# Altium project driver_led_matrix.PrjPcb
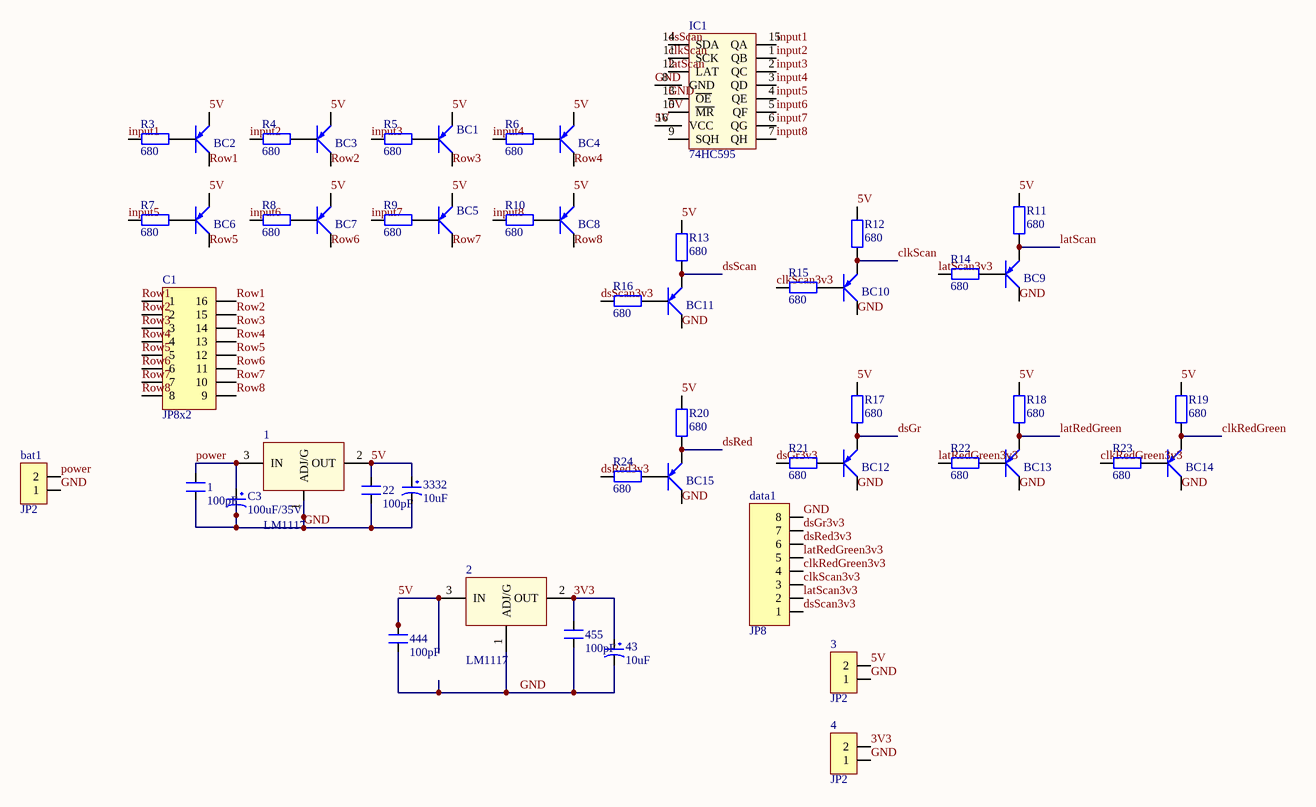
[diagram p0: Sheet1.SchDoc]
1 sheet, 52 parts. Net scope: global (net labels, ports and power ports of the same name join across sheets).
Board file: PCB2.PcbDoc

## Sheet Sheet1.SchDoc
size A0

### Parts
(Parts that share a designator on the sheet are numbered #1, #2 ... from top to bottom, then left to right.)
1#1  LM1117  [SOT223-4N]
1#2  100pF  [CN1]
2  LM1117  [SOT223-4N]
3  JP2  [JP2-C1T]
4  JP2  [JP2-C1T]
22  100pF  [CN1]
43  10uF  [CP1/2]
444  100pF  [CN1]
455  100pF  [CN1]
3332  10uF  [CP1/2]
bat1  JP2  [JP2-C1T]
BC1  A1015  [SOT23B]  (value not drawn)
BC2  A1015  [SOT23B]  (value not drawn)
BC3  A1015  [SOT23B]  (value not drawn)
BC4  A1015  [SOT23B]  (value not drawn)
BC5  A1015  [SOT23B]  (value not drawn)
BC6  A1015  [SOT23B]  (value not drawn)
BC7  A1015  [SOT23B]  (value not drawn)
BC8  A1015  [SOT23B]  (value not drawn)
BC9  A1015  [SOT23B]  (value not drawn)
BC10  A1015  [SOT23B]  (value not drawn)
BC11  A1015  [SOT23B]  (value not drawn)
BC12  A1015  [SOT23B]  (value not drawn)
BC13  A1015  [SOT23B]  (value not drawn)
BC14  A1015  [SOT23B]  (value not drawn)
BC15  A1015  [SOT23B]  (value not drawn)
C1  JP8x2  [JP8-D2T]
C3  100uF/35V  [CP1.5/3.4]
data1  JP8  [JP8-D1C]
IC1  74HC595  [SO16]
R3  680  [R1/4W]
R4  680  [R1/4W]
R5  680  [R1/4W]
R6  680  [R1/4W]
R7  680  [R1/4W]
R8  680  [R1/4W]
R9  680  [R1/4W]
R10  680  [R1/4W]
R11  680  [R1/4W]
R12  680  [R1/4W]
R13  680  [R1/4W]
R14  680  [R1/4W]
R15  680  [R1/4W]
R16  680  [R1/4W]
R17  680  [R1/4W]
R18  680  [R1/4W]
R19  680  [R1/4W]
R20  680  [R1/4W]
R21  680  [R1/4W]
R22  680  [R1/4W]
R23  680  [R1/4W]
R24  680  [R1/4W]

### Nets
5V: 1#1.2(OUT) 2.3(IN) 3.2 22.2 444.2 3332.1 BC1.1(E) BC2.1(E) BC3.1(E) BC4.1(E) BC5.1(E) BC6.1(E) BC7.1(E) BC8.1(E) IC1.10(~{MR}) IC1.16(VCC) R11.2 R12.2 R13.2 R17.2 R18.2 R19.1 R20.2  [also labelled VCC]
GND: 1#1.1(ADJ/G) 1#2.1 2.1(ADJ/G) 3.1 4.1 22.1 43.2 444.1 455.1 3332.2 bat1.1 BC9.2(C) BC10.2(C) BC11.2(C) BC12.2(C) BC13.2(C) BC14.2(C) BC15.2(C) C3.2 data1.8 IC1.8(GND) IC1.13(~{OE})
3V3: 2.2(OUT) 4.2 43.1 455.2
clkRedGreen: BC14.1(E) R19.2
clkRedGreen3v3: data1.4 R23.2
clkScan: BC10.1(E) IC1.11(SCK) R12.1
clkScan3v3: data1.3 R15.1
dsGr: BC12.1(E) R17.1
dsGr3v3: data1.7 R21.1
dsRed: BC15.1(E) R20.1
dsRed3v3: data1.6 R24.1
dsScan: BC11.1(E) IC1.14(SDA) R13.1
dsScan3v3: data1.1 R16.1
input1: IC1.15(QA) R3.1
input2: IC1.1(QB) R4.1
input3: IC1.2(QC) R5.1
input4: IC1.3(QD) R6.1
input5: IC1.4(QE) R7.1
input6: IC1.5(QF) R8.1
input7: IC1.6(QG) R9.1
input8: IC1.7(QH) R10.1
latRedGreen: BC13.1(E) R18.1
latRedGreen3v3: data1.5 R22.1
latScan: BC9.1(E) IC1.12(LAT) R11.1
latScan3v3: data1.2 R14.1
power: 1#1.3(IN) 1#2.2 bat1.2 C3.1
Row1: BC2.2(C) C1.1 C1.16
Row2: BC3.2(C) C1.2 C1.15
Row3: BC1.2(C) C1.3 C1.14
Row4: BC4.2(C) C1.4 C1.13
Row5: BC6.2(C) C1.5 C1.12
Row6: BC7.2(C) C1.6 C1.11
Row7: BC5.2(C) C1.7 C1.10
Row8: BC8.2(C) C1.8 C1.9
NetBC1_3: BC1.3(B) R5.2
NetBC2_3: BC2.3(B) R3.2
NetBC3_3: BC3.3(B) R4.2
NetBC4_3: BC4.3(B) R6.2
NetBC5_3: BC5.3(B) R9.2
NetBC6_3: BC6.3(B) R7.2
NetBC7_3: BC7.3(B) R8.2
NetBC8_3: BC8.3(B) R10.2
NetBC9_3: BC9.3(B) R14.2
NetBC10_3: BC10.3(B) R15.2
NetBC11_3: BC11.3(B) R16.2
NetBC12_3: BC12.3(B) R21.2
NetBC13_3: BC13.3(B) R22.2
NetBC14_3: BC14.3(B) R23.1
NetBC15_3: BC15.3(B) R24.2

Not connected (* = marked no-connect by the designer): IC1 9(SQH)

### Library data of the parts
1#1 2 = LM1117: Available in 1.8V, 2.5V, 2.85V, 3.3V, 5V, and  Adjustable Versions; Value: LM317
1#2 22 444 455 = CN1: Cap np  1pF - 472pF; Value: 100pF
3 4 bat1 = JP2: WR-PHD 2.54 mm Angled Socket Header; Manufacturer: W¨¹rth Elektronik eiSos GmbH; partNo: 613002143121; ComponentLink1 Description: Manufacturer; ComponentLink2 Description: Datasheet; NoPins: 02; Created Date: 29 March 2013; ComponentLink1URL: http://www.we-online.com; ComponentLink2URL: http://katalog.we-online.de/em/datasheet/6130xx143121.pdf; Created by: Karrer Zheng
43 3332 = CP1: Cap P  0,1uF < 22uF , 16 - 50V; Value: 10uF/50V; Description 1: 10 => 220uF/6,3V/10V - 10uF => 100uF/16V; Description 2: 0,1uF => 33uF/50V - 10uF => 22uF/63V; Description 3: 0,47uF => 10uF/100V
BC1-BC15 = A1015: PNP 600mW, ECB; Value: A1015
C1 = JP8x2: WR-PHD 2.54 mm Dual Socket Header; Manufacturer: W¨¹rth Elektronik eiSos GmbH; partNo: 61301621821; ComponentLink1 Description: Manufacturer; ComponentLink2 Description: Datasheet; NoPins: 16; Created Date: 29 March 2013; ComponentLink1URL: http://www.we-online.com; ComponentLink2URL: http://katalog.we-online.de/em/datasheet/6130xx21821.pdf; Created by: Karrer Zheng
C3 = CP3: Cap 100uF/35V - 470uF/16V; Value: 100uF/35V/50V; Description 1: 1000uF/6,3V - 470uF/16V - 330uF - 25V; Description 2: 220uF/35V - 100uF/50V - 63V - 4,7uF/200V; Description 3: 22uF => 33uF100V - 3,3uF => 4,7uF/250V; Description 4: 2,2uF =>3,3uF/350 - 2,2uF/400V - 1uF/450V
data1 = JP8: WR-PHD 2.54 mm Angled Socket Header; Manufacturer: W¨¹rth Elektronik eiSos GmbH; partNo: 613008143121; ComponentLink1 Description: Manufacturer; ComponentLink2 Description: Datasheet; NoPins: 08; Created Date: 29 March 2013; ComponentLink1URL: http://www.we-online.com; ComponentLink2URL: http://katalog.we-online.de/em/datasheet/6130xx143121.pdf; Created by: Karrer Zheng
IC1 = 74595: 8 Bit Serial input - Parallel Output; Value: 74HC595
R3-R24 = R1/4W: Resistor 1/4W; Value: R1/4W - 1K